# Altium schematic sheet 001-0001_Christmas_Ornament_LEDs.SchDoc: Christmas Ornament
size A3; ApprovedBy: [FILL-HERE]; Author: HILT; Organization: Hilt; Address1: [FILL-HERE]; Address2: [FILL-HERE]; Address3: [FILL-HERE]; Address4: [FILL-HERE]; DocumentNumber: 001-0001; Revision: 0; SheetNumber: 1; SheetTotal: 2; ProjectTitle: Christmas Ornament
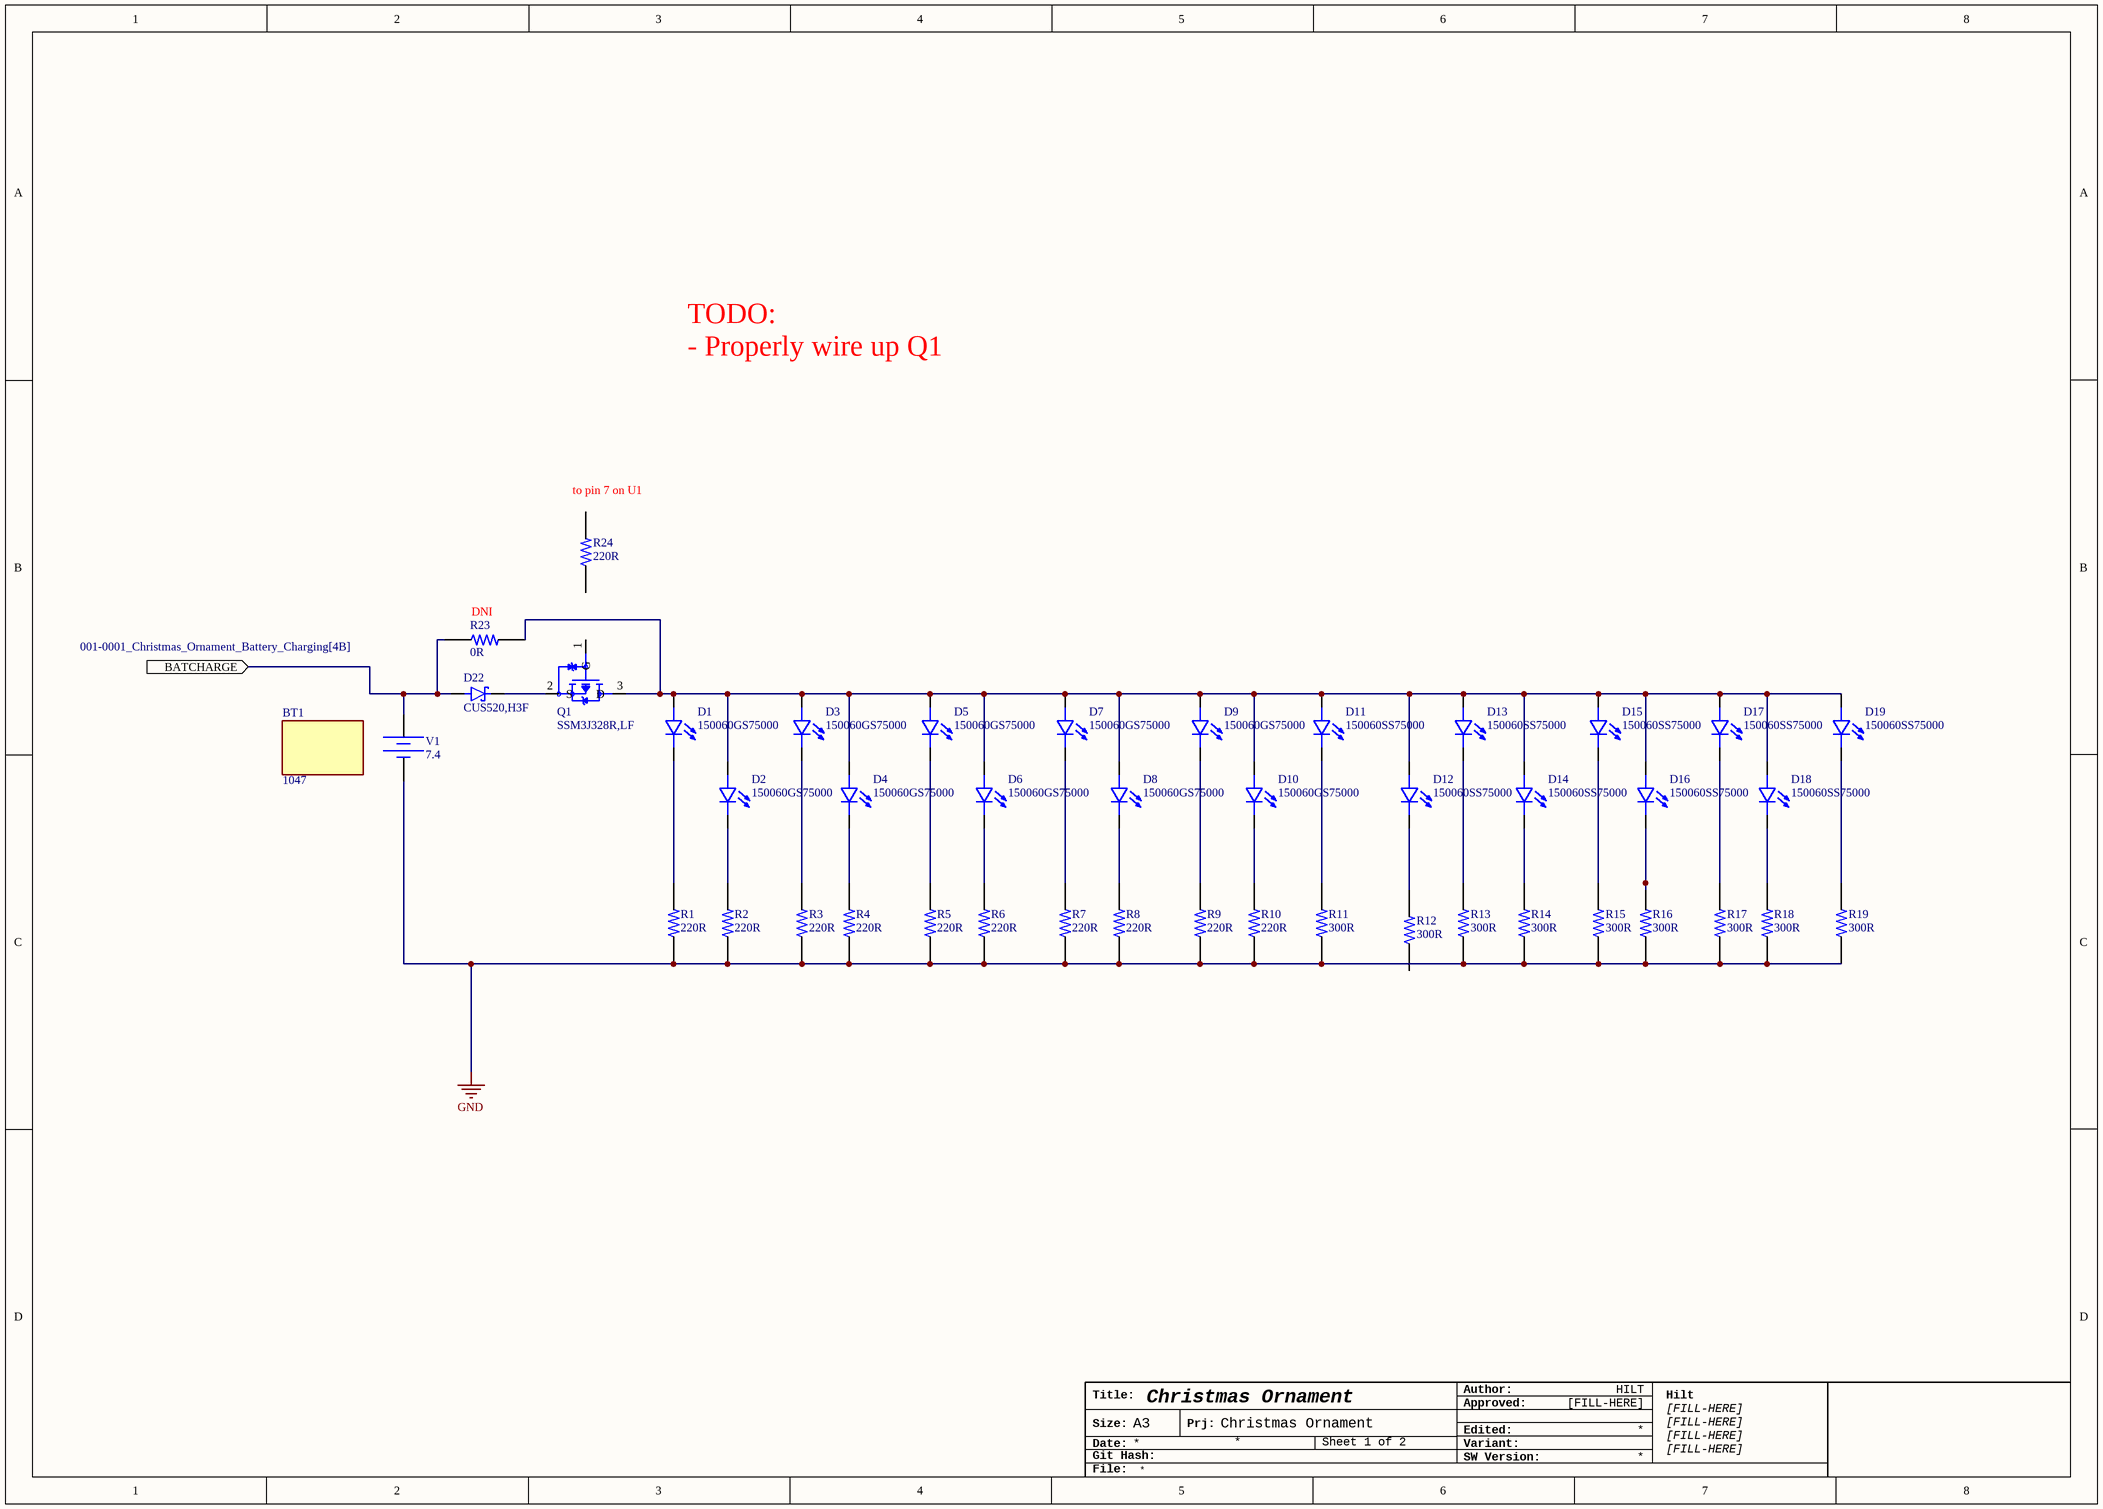
[diagram p0: 001-0001_Christmas_Ornament_LEDs.SchDoc]

## Parts
BT1  1047  [BAT_1047]
D1  150060GS75000  [LEDC1608X80N]
D2  150060GS75000  [LEDC1608X80N]
D3  150060GS75000  [LEDC1608X80N]
D4  150060GS75000  [LEDC1608X80N]
D5  150060GS75000  [LEDC1608X80N]
D6  150060GS75000  [LEDC1608X80N]
D7  150060GS75000  [LEDC1608X80N]
D8  150060GS75000  [LEDC1608X80N]
D9  150060GS75000  [LEDC1608X80N]
D10  150060GS75000  [LEDC1608X80N]
D11  150060SS75000  [LED_150060SS75000]
D12  150060SS75000  [LED_150060SS75000]
D13  150060SS75000  [LED_150060SS75000]
D14  150060SS75000  [LED_150060SS75000]
D15  150060SS75000  [LED_150060SS75000]
D16  150060SS75000  [LED_150060SS75000]
D17  150060SS75000  [LED_150060SS75000]
D18  150060SS75000  [LED_150060SS75000]
D19  150060SS75000  [LED_150060SS75000]
D22  CUS520,H3F  [CUS520,H3F]
Q1  SSM3J328R,LF  [SSM3J328R,LF]
R1  220R  [ERJ-PA3F51R0V]
R2  220R  [ERJ-PA3F51R0V]
R3  220R  [ERJ-PA3F51R0V]
R4  220R  [ERJ-PA3F51R0V]
R5  220R  [ERJ-PA3F51R0V]
R6  220R  [ERJ-PA3F51R0V]
R7  220R  [ERJ-PA3F51R0V]
R8  220R  [ERJ-PA3F51R0V]
R9  220R  [ERJ-PA3F51R0V]
R10  220R  [ERJ-PA3F51R0V]
R11  300R  [ERJ-PA3F51R0V]
R12  300R  [ERJ-PA3F51R0V]
R13  300R  [ERJ-PA3F51R0V]
R14  300R  [ERJ-PA3F51R0V]
R15  300R  [ERJ-PA3F51R0V]
R16  300R  [ERJ-PA3F51R0V]
R17  300R  [ERJ-PA3F51R0V]
R18  300R  [ERJ-PA3F51R0V]
R19  300R  [ERJ-PA3F51R0V]
R23  0R  [ERJ-PA3F51R0V]
R24  220R  [ERJ-PA3F51R0V]
V1  DC Magnitude: 7.4  (hidden comment: Constant Voltage Source)

## Ports
BATCHARGE (in, see 001-0001_Christmas_Ornament_Battery_Charging[4B])

## Nets
GND: R1.1 R2.1 R3.1 R4.1 R5.1 R6.1 R7.1 R8.1 R9.1 R10.1 R11.1 R13.1 R14.1 R15.1 R16.1 R17.1 R18.1 R19.1 V1.2
BATCHARGE: D22.A R23.1 V1.1 ; port BATCHARGE
NetD1_A: D1.A D2.A D3.A D4.A D5.A D6.A D7.A D8.A D9.A D10.A D11.A D12.A D13.A D14.A D15.A D16.A D17.A D18.A D19.A Q1.3(D) R23.2
NetD1_C: D1.C R1.2
NetD2_C: D2.C R2.2
NetD3_C: D3.C R3.2
NetD4_C: D4.C R4.2
NetD5_C: D5.C R5.2
NetD6_C: D6.C R6.2
NetD7_C: D7.C R7.2
NetD8_C: D8.C R8.2
NetD9_C: D9.C R9.2
NetD10_C: D10.C R10.2
NetD11_C: D11.C R11.2
NetD12_C: D12.C R12.2
NetD13_C: D13.C R13.2
NetD14_C: D14.C R14.2
NetD15_C: D15.C R15.2
NetD16_C: D16.C R16.2
NetD17_C: D17.C R17.2
NetD18_C: D18.C R18.2
NetD19_C: D19.C R19.2
NetD22_C: D22.C Q1.2(S)

Not connected (* = marked no-connect by the designer): Q1 1(G); R12 1; R24 1 2

## Notes on the sheet
- (near R24) to pin 7 on U1
- TODO:
  - Properly wire up Q1
- (near R23) DNI
- Title:
- Author:
- Approved:
- Size:
- Date:
- Git Hash:
- A3
- Prj:
- SW Version:
- Variant:
- Edited:
- File:

## Library data of the parts
BT1 = 1047: 18650 Dual Battery Holder; Package: None; Price: None; Value: *; MP: 1047; Availability: Unavailable; Supplier 1: Digikey; Supplier Part Number 1: 36-1047-ND
D1-D10 = 150060GS75000: Green 520nm LED Indication - Discrete 3.2V 0603 (1608 Metric); MF: Wurth Electronics; SnapEDA_Link: https://www.snapeda.com/parts/150060GS75000/Wurth%20Electronics%20Inc./view-part/548131/?ref=snap; Availability: Warning; Price: None; Value: *; DigiKey-Purchase-URL: https://snapeda.com/shop?store=DigiKey&id=548131; Mouser-Purchase-URL: https://snapeda.com/shop?store=Mouser&id=548131; MP: 150060GS75000; Package: 0603 WÃ¼rth Elektronik; Supplier 1: Digikey; Supplier Part Number 1: 732-4971-1-ND
D11-D19 = 150060SS75000: Red 630nm LED Indication - Discrete 1.9V 0603 (1608 Metric)  <a href="https://pricing.snapeda.com/parts/150060SS75000/W%C3%BCrth%20Elektronik/view-part?ref=eda">Check availability</a>; MF: {'manufacturer': u'Wurth Electronics'}; Package: None; Price: None; Value: *; MP: 150060SS75000; Availability: Unavailable; Supplier 1: Digikey; Supplier Part Number 1: 732-4979-1-ND
D22 = CUS520,H3F: Diode Schottky 30V 200mA Surface Mount USC; MF: Toshiba Semiconductor; Value: *; MP: CUS520,H3F; Price: None; Availability: Unavailable; Package: SOD-323 Toshiba; SnapEDA_Link: https://www.snapeda.com/parts/CUS520,H3F/Toshiba%20Semiconductor%20and%20Storage/view-part/638889/?ref=snap
Q1 = SSM3J328R,LF: P-Channel 20V 6A _Ta_ 1W _Ta_ Surface Mount SOT-23F; MF: Toshiba; MP: SSM3J328R,LF; SnapEDA_Link: https://www.snapeda.com/parts/SSM3J328R,LF/Toshiba%20Semiconductor%20and%20Storage/view-part/214715/?ref=snap; Availability: Unavailable; Package: SOT-23 Toshiba; Value: *; Price: None
R1-R10 = ERJ-PA3F2200V: RES SMD 220 OHM 1% 1/3W 0603; MP: ERJPA3F51R0V; Price: None; Value: *; Availability: Unavailable; Package: None; Supplier 1: Mouser; Supplier Part Number 1: 667-ERJ-PA3F2200V
R11-R19 = ERJ-PA3F3000V: RES SMD 300 OHM 1% 1/3W 0603; MP: ERJPA3F51R0V; Price: None; Value: *; Availability: Unavailable; Package: None; Supplier 1: Mouser; Supplier Part Number 1: 667-ERJ-PA3F3000V
R23 = ERJ-3GEY0R00V: RES SMD 0 OHM JUMPER 1/10W 0603; MP: ERJPA3F51R0V; Price: None; Value: *; Availability: Unavailable; Package: None; Supplier 1: Mouser; Supplier Part Number 1: 667-ERJ-3GEY0R00V
R24 = ERJ-3EKF1002V: RES SMD 10K OHM 1% 1/10W 0603; MP: ERJPA3F51R0V; Price: None; Value: *; Availability: Unavailable; Package: None; Supplier 1: Mouser; Supplier Part Number 1: 667-ERJ-3EKF1002V
V1 = Battery: SimulationGenericComponent: True